# Altium schematic sheet 电机驱动.SchDoc
size A4
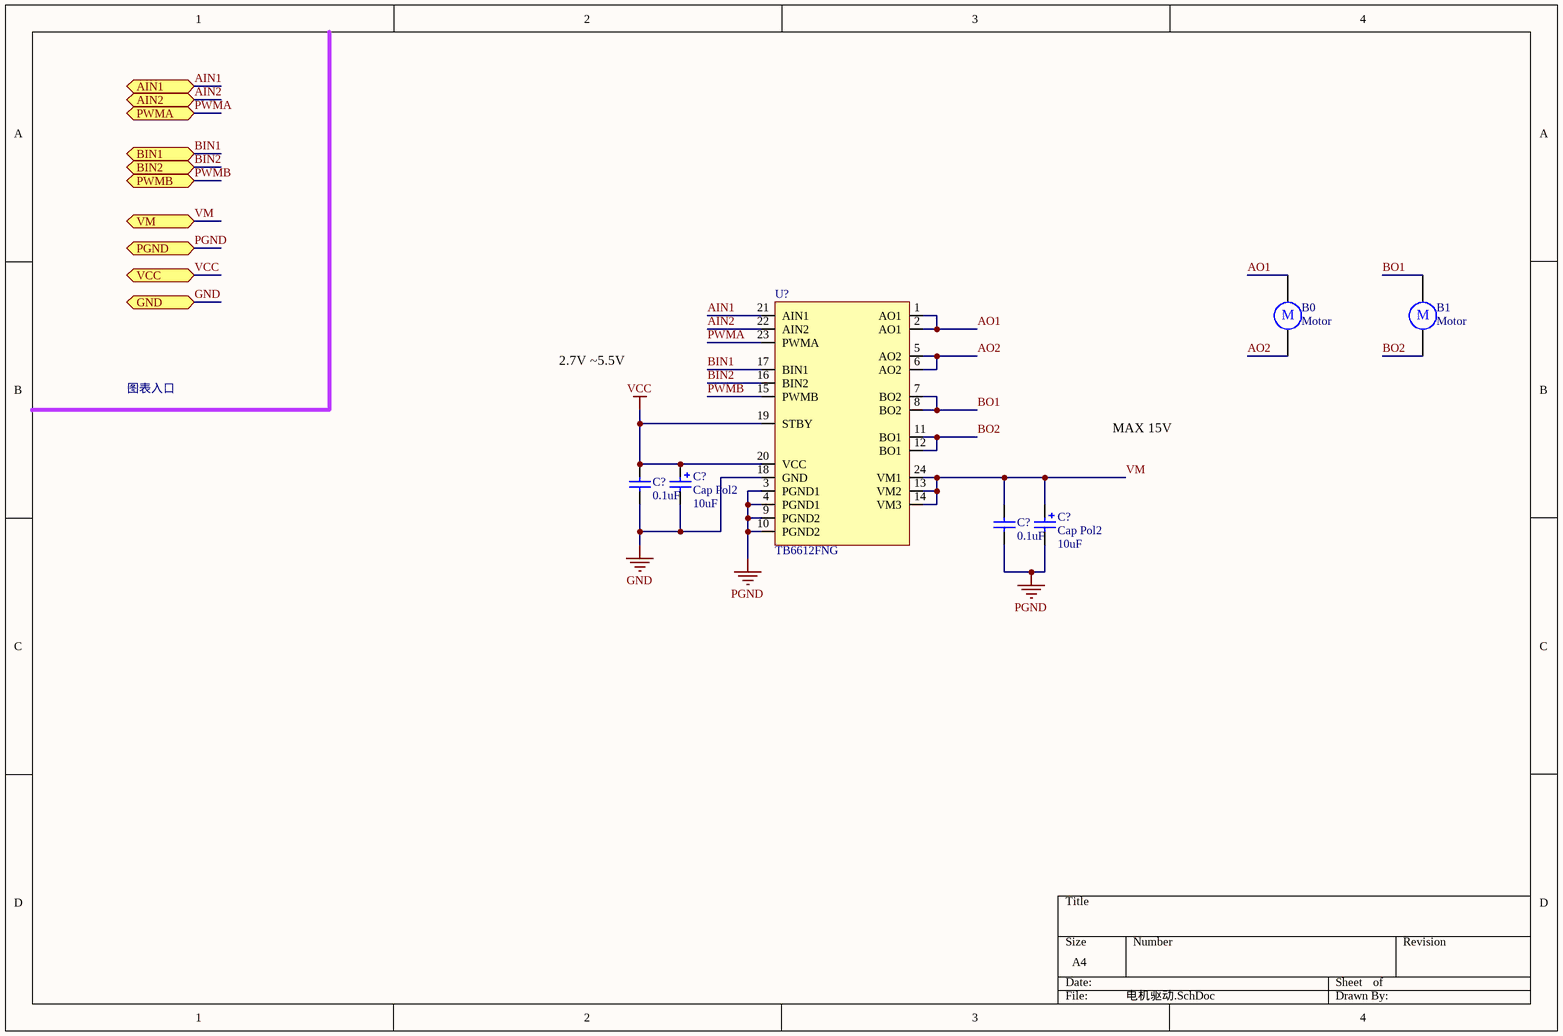
[diagram p0: 电机驱动.SchDoc]

## Parts
(Parts that share a designator on the sheet are numbered #1, #2 ... from top to bottom, then left to right.)
B0  Motor  [RB5-10.5]
B1  Motor  [RB5-10.5]
C?#1  Cap Pol2  value 10uF  [POLAR0.8]
C?#2  value 0.1uF  [6-0805_N]  (hidden comment: Cap)
C?#3  Cap Pol2  value 10uF  [POLAR0.8]
C?#4  value 0.1uF  [6-0805_N]  (hidden comment: Cap)
U?  TB6612FNG

## Ports
AIN1, AIN2, BIN1, BIN2, GND, PGND, PWMA, PWMB, VCC, VM

## Nets
GND: C?#1.2 C?#2.1 U?.18(GND) ; port GND
PGND: C?#3.2 C?#4.1 U?.3(PGND1) U?.4(PGND1) U?.9(PGND2) U?.10(PGND2) ; port PGND
VCC: C?#1.1 C?#2.2 U?.19(STBY) U?.20(VCC) ; port VCC
AIN1: U?.21(AIN1) ; port AIN1
AIN2: U?.22(AIN2) ; port AIN2
AO1: B0.1 U?.1(AO1) U?.2(AO1)
AO2: B0.2 U?.5(AO2) U?.6(AO2)
BIN1: U?.17(BIN1) ; port BIN1
BIN2: U?.16(BIN2) ; port BIN2
BO1: B1.1 U?.7(BO2) U?.8(BO2)
BO2: B1.2 U?.11(BO1) U?.12(BO1)
PWMA: U?.23(PWMA) ; port PWMA
PWMB: U?.15(PWMB) ; port PWMB
VM: C?#3.1 C?#4.2 U?.13(VM2) U?.14(VM3) U?.24(VM1) ; port VM

## Notes on the sheet
- 2.7V ~5.5V
- 图表入口
- MAX 15V
- (in symbol Motor) M

## Library data of the parts
B0 B1 = Motor: Motor, General Kind; Published: 24-Mar-1999; LatestRevisionDate: 17-Jul-2002; LatestRevisionNote: Re-released for DXP Platform.; PackageReference: RB5-10.5; Publisher: Altium Limited; PackageDescription: Capacitor (Radial); 2 Leads
C?#1 C?#3 = Cap Pol2: Polarized Capacitor (Axial); Published: 8-Jun-2000; LatestRevisionDate: 17-Jul-2002; LatestRevisionNote: Re-released for DXP Platform.; PackageReference: POLAR0.8; Publisher: Altium Limited; PackageDescription: Polarized Capacitor; 2 Leads
C?#2 C?#4 = Cap: Capacitor; Published: 8-Jun-2000; LatestRevisionDate: 17-Jul-2002; LatestRevisionNote: Re-released for DXP Platform.; PackageReference: RAD-0.3; Publisher: Altium Limited; PackageDescription: Radial Cap, Thru-Hole; 2 Leads; 0.3 in Pin Spacing